# Altium schematic sheet AD.SchDoc
size A4
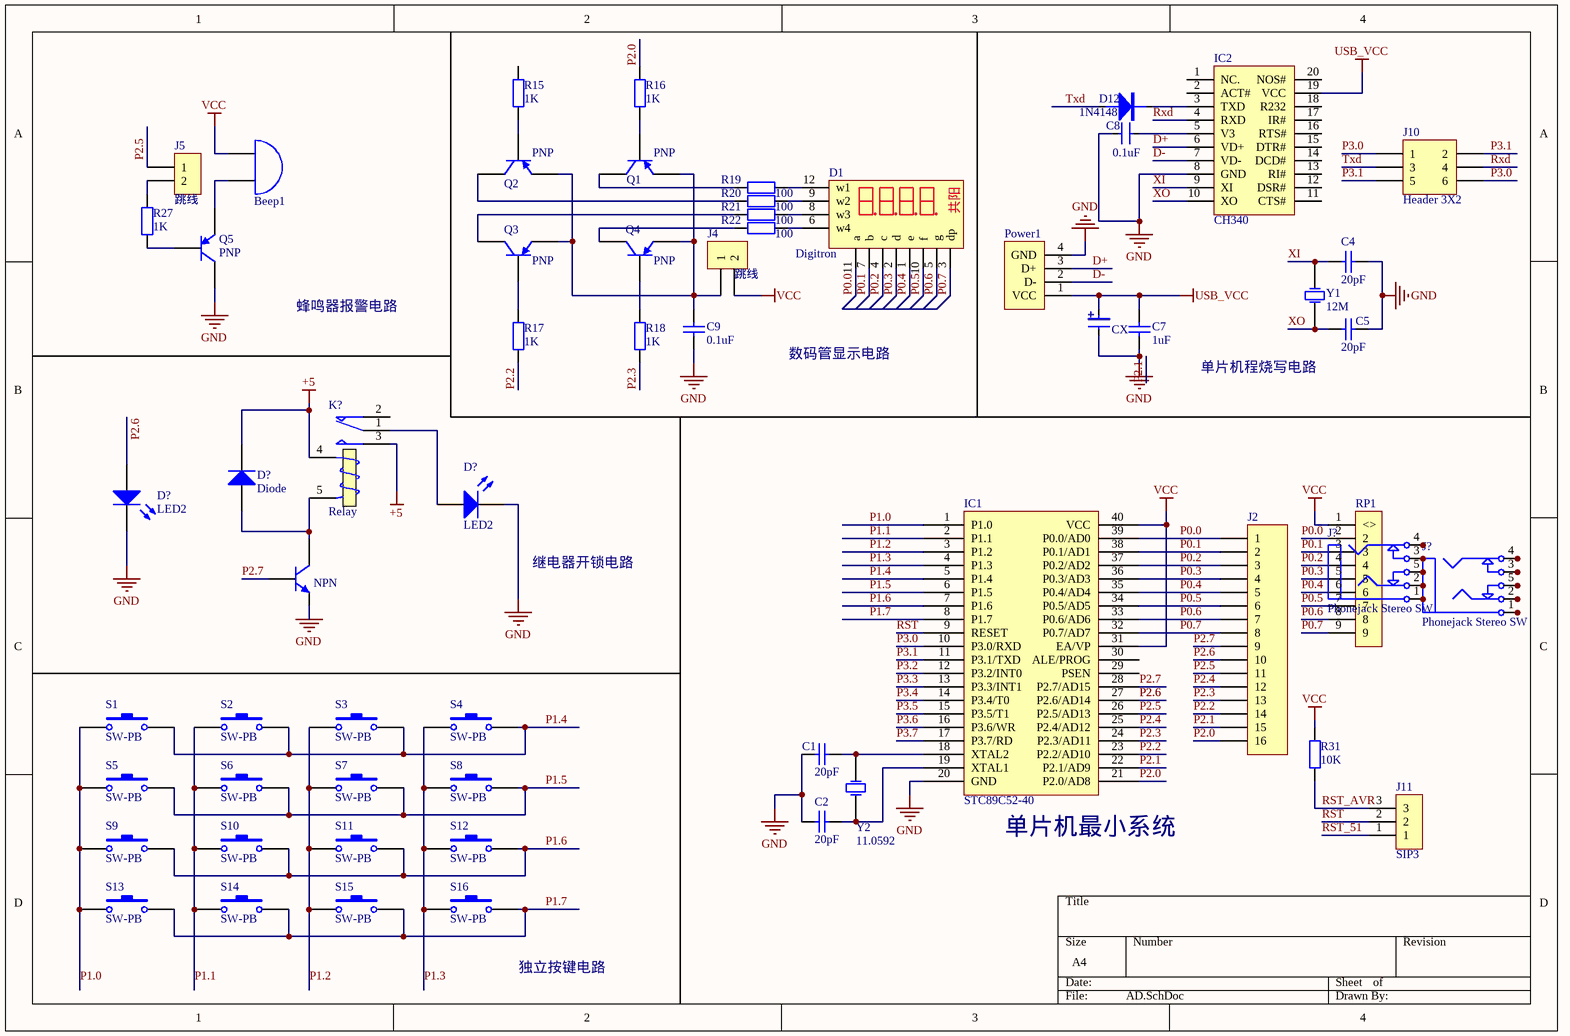
[diagram p0: AD.SchDoc]

## Parts
(Parts that share a designator on the sheet are numbered #1, #2 ... from top to bottom, then left to right.)
?  NPN  [TO-226-AA]
Beep1  蜂鸣器  [beep]  (value not drawn)
C1  value 20pF  [0805_C]  (hidden comment: Cap_SMT)
C2  value 20pF  [0805_C]  (hidden comment: Cap_SMT)
C4  value 20pF  [0805_C]  (hidden comment: Cap_SMT)
C5  value 20pF  [0805_C]  (hidden comment: Cap_SMT)
C7  value 1uF  [0805_C]  (hidden comment: Cap_SMT)
C8  value 0.1uF  [0805C]  (hidden comment: C0805)
C9  value 0.1uF  [0805_C]  (hidden comment: Cap_SMT)
CX  C1206  [C1206_C]  (value not drawn)
D1  Digitron  [Ditigron_Pack]
D12  1N4148  [0805D]
D?#1  Diode  [SMC]
D?#2  LED2  [3.2X1.6X1.1]
D?#3  LED2  [3.2X1.6X1.1]
IC1  STC89C52-40  [DIP_40S]
IC2  CH340  [SSOP-20]
J2  Header 16  [HDR1X16]  (value not drawn)
J4  跳线  [SIP2-0.254]
J5  跳线  [SIP2-0.254]
J10  Header 3X2  [HDR2X3]
J11  SIP3  [SIP3.0-0.254]
J?#1  Phonejack Stereo SW  [ST-3150-5N]
J?#2  Phonejack Stereo SW  [ST-3150-5N]
K?  Relay  [MODULE5B]
Power1  USB-B  [USB-B]  (value not drawn)
Q1  PNP  [SOT-23Q]
Q2  PNP  [SOT-23Q]
Q3  PNP  [SOT-23Q]
Q4  PNP  [SOT-23Q]
Q5  PNP  [SOT-23Q]
R15  value 1K  [0805_R]  (hidden comment: Res_SMT)
R16  value 1K  [0805_R]  (hidden comment: Res_SMT)
R17  value 1K  [0805_R]  (hidden comment: Res_SMT)
R18  value 1K  [0805_R]  (hidden comment: Res_SMT)
R19  value 100  [0805_R]  (hidden comment: Res_SMT)
R20  value 100  [0805_R]  (hidden comment: Res_SMT)
R21  value 100  [0805_R]  (hidden comment: Res_SMT)
R22  value 100  [0805_R]  (hidden comment: Res_SMT)
R27  value 1K  [0805_R]  (hidden comment: Res_SMT)
R31  value 10K  [0805_R]  (hidden comment: Res_SMT)
RP1  排阻9脚  [R9PIN]  (value not drawn)
S1  SW-PB  [SPST-2]
S2  SW-PB  [SPST-2]
S3  SW-PB  [SPST-2]
S4  SW-PB  [SPST-2]
S5  SW-PB  [SPST-2]
S6  SW-PB  [SPST-2]
S7  SW-PB  [SPST-2]
S8  SW-PB  [SPST-2]
S9  SW-PB  [SPST-2]
S10  SW-PB  [SPST-2]
S11  SW-PB  [SPST-2]
S12  SW-PB  [SPST-2]
S13  SW-PB  [SPST-2]
S14  SW-PB  [SPST-2]
S15  SW-PB  [SPST-2]
S16  SW-PB  [SPST-2]
Y1  12M  [HC-49S]
Y2  11.0592  [HC-49S]

## Nets
+5: D?#1.2(K) K?.3(NO) K?.4(T1)
GND: ?.3(E) C1.2 C2.2 C4.2 C5.2 C7.2 C8.1 C9.1 CX.2 D?#2.2(K) D?#3.2(K) IC1.20(GND) IC2.8(GND) Power1.4(GND) Q5.C
USB_VCC: C7.1 CX.1 IC2.19(VCC) Power1.1(VCC)
VCC: Beep1.2(B) IC1.31(EA/VP) IC1.40(VCC) J4.2 R31.2 RP1.1(<>)
D+: IC2.6(VD+) Power1.3(D+)
D-: IC2.7(VD-) Power1.2(D-)
P0.0: D1.11(a) IC1.39(P0.0/AD0) J2.1 RP1.2
P0.1: D1.7(b) IC1.38(P0.1/AD1) J2.2 RP1.3
P0.2: D1.4(c) IC1.37(P0.2/AD2) J2.3 RP1.4
P0.3: D1.2(d) IC1.36(P0.3/AD3) J2.4 RP1.5
P0.4: D1.1(e) IC1.35(P0.4/AD4) J2.5 RP1.6
P0.5: D1.10(f) IC1.34(P0.5/AD5) J2.6 RP1.7
P0.6: D1.5(g) IC1.33(P0.6/AD6) J2.7 RP1.8
P0.7: D1.3(dp) IC1.32(P0.7/AD7) J2.8 RP1.9
P1.0: IC1.1(P1.0) S1.1 S5.1 S9.1 S13.1
P1.1: IC1.2(P1.1) S2.1 S6.1 S10.1 S14.1
P1.2: IC1.3(P1.2) S3.1 S7.1 S11.1 S15.1
P1.3: IC1.4(P1.3) S4.1 S8.1 S12.1 S16.1
P1.4: IC1.5(P1.4) S1.2 S2.2 S3.2 S4.2
P1.5: IC1.6(P1.5) S5.2 S6.2 S7.2 S8.2
P1.6: IC1.7(P1.6) S9.2 S10.2 S11.2 S12.2
P1.7: IC1.8(P1.7) S13.2 S14.2 S15.2 S16.2
P2.0: IC1.21(P2.0/AD8) J2.16 R16.2
P2.1: IC1.22(P2.1/AD9) J2.15
P2.2: IC1.23(P2.2/AD10) J2.14 R17.1
P2.3: IC1.24(P2.3/AD11) J2.13 R18.1
P2.4: IC1.25(P2.4/AD12) J2.12
P2.5: IC1.26(P2.5/AD13) J2.11 J5.1
P2.6: D?#2.1(A) IC1.27(P2.6/AD14) J2.10
P2.7: ?.2(B) IC1.28(P2.7/AD15) J2.9
P3.0: IC1.10(P3.0/RXD) J10.1 J10.6
P3.1: IC1.11(P3.1/TXD) J10.2 J10.5
P3.2: IC1.12(P3.2/INT0)
P3.3: IC1.13(P3.3/INT1)
P3.4: IC1.14(P3.4/T0)
P3.5: IC1.15(P3.5/T1)
P3.6: IC1.16(P3.6/WR)
P3.7: IC1.17(P3.7/RD)
RST: IC1.9(RESET) J11.2
RST_51: J11.1
RST_AVR: J11.3 R31.1
Rxd: IC2.4(RXD) J10.4
Txd: D12.A J10.3
XI: C4.1 IC2.9(XI) Y1.2
XO: C5.1 IC2.10(XO) Y1.1
Net?_1: ?.1(C) D?#1.1(A) K?.5(T2)
NetBeep1_1: Beep1.1(A) Q5.E
NetC1_1: C1.1 IC1.18(XTAL2) Y2.1
NetC2_1: C2.1 IC1.19(XTAL1) Y2.2
NetC8_2: C8.2 IC2.5(V3)
NetC9_2: C9.2 J4.1 Q1.E Q2.E Q3.E Q4.E
NetD1_6: D1.6(w4) R22.2
NetD1_8: D1.8(w3) R21.2
NetD1_9: D1.9(w2) R20.2
NetD1_12: D1.12(w1) R19.2
NetD12_K: D12.K IC2.3(TXD)
NetD?#3_1: D?#3.1(A) K?.1(COM)
NetJ5_2: J5.2 R27.2
NetJ?#1_1: J?#1.1 J?#1.1A J?#1.1B
NetJ?#1_2: J?#1.2 J?#1.2A J?#1.2B
NetJ?#1_3: J?#1.3 J?#1.3A J?#1.3B
NetJ?#1_4: J?#1.4 J?#1.4A J?#1.4B
NetJ?#1_5: J?#1.5 J?#1.5A J?#1.5B
NetJ?#2_1: J?#2.1 J?#2.1A J?#2.1B
NetJ?#2_2: J?#2.2 J?#2.2A J?#2.2B
NetJ?#2_3: J?#2.3 J?#2.3A J?#2.3B
NetJ?#2_4: J?#2.4 J?#2.4A J?#2.4B
NetJ?#2_5: J?#2.5 J?#2.5A J?#2.5B
NetQ1_B: Q1.B R16.1
NetQ1_C: Q1.C R19.1
NetQ2_B: Q2.B R15.1
NetQ2_C: Q2.C R20.1
NetQ3_B: Q3.B R17.2
NetQ3_C: Q3.C R21.1
NetQ4_B: Q4.B R18.2
NetQ4_C: Q4.C R22.1
NetQ5_B: Q5.B R27.1

Not connected (* = marked no-connect by the designer): IC1 29(PSEN) 30(ALE/PROG); IC2 1(NC.) 2(ACT#) 11(CTS#) 12(DSR#) 13(RI#) 14(DCD#) 15(DTR#) 16(RTS#) 17(IR#) 18(R232) 20(NOS#); K? 2(NC); R15 2

## Notes on the sheet
- 蜂鸣器报警电路
- 数码管显示电路
- 单片机程烧写电路
- 继电器开锁电路
- (near IC1) 单片机最小系统
- 独立按键电路
- (in symbol Digitron) 共阳; .

## Library data of the parts
? = NPN: NPN Bipolar Transistor; Published: 8-Jun-2000; LatestRevisionDate: 17-Jul-2002; LatestRevisionNote: Re-released for DXP Platform.; PackageReference: TO-226-AA; Publisher: Altium Limited; PackageDescription: TO, Flat Index; 3 In-Line, Axial Leads; Body Dia. 4.8mm; Leads 0.55 x 0.51 mm (max); Code_JEDEC: TO-226-AA
C1 C2 C4 C5 C7 C9 = Cap_SMT: Capacitor
CX = 钽电容1206: Value: 10uF
D12 = 0805D
D?#1 = Diode: Default Diode; Published: 8-Jun-2000; LatestRevisionDate: 17-Jul-2002; LatestRevisionNote: Re-released for DXP Platform.; PackageVersion: Sep-1996; PackageReference: SMC; Publisher: Altium Limited; PackageDescription: DO-214-AB/SMC; 2 C-Bend Leads; Body 7.9 x 5.9 mm, inc. leads (LxW); Code_JEDEC: DO-214-AB
D?#2 D?#3 = LED2: Typical RED, GREEN, YELLOW, AMBER GaAs LED; Published: 8-Jun-2000; LatestRevisionDate: 17-Jul-2002; LatestRevisionNote: Re-released for DXP Platform.; PackageVersion: Feb-2002; PackageReference: 3.2X1.6X1.1; Publisher: Altium Limited; PackageDescription: SM LED; 2 Flat Leads
J2 = Header 16: Header, 16-Pin; LatestRevisionDate: 17-Jul-2002; LatestRevisionNote: Re-released for DXP Platform.; Publisher: Altium Limited
J4 J5 = SIP2-0.254
J10 = Header 3X2: Header, 3-Pin, Dual row; LatestRevisionDate: 17-Jul-2002; LatestRevisionNote: Re-released for DXP Platform.; Publisher: Altium Limited
J11 = SIP3.0-0.254
J?#1 J?#2 = Phonejack Stereo SW: 3-Conductor Jack with 2 break contacts (normals) and 2 auxiliary make contacts; Published: 5-Jan-2004; LatestRevisionDate: 17-Dec-2003; LatestRevisionNote: PCB Footprint replaced.; DatasheetDocument: 07-Mar-2000; Publisher: Altium Limited; ComponentLink1Description: Manufacturer Link; ComponentLink1URL: http://domino.kycon.com/internet/Products.html
K? = Relay: SPDT Relay; Published: 8-Jun-2000; LatestRevisionDate: 17-Jul-2002; LatestRevisionNote: Re-released for DXP Platform.; PackageReference: MODULE5B; Publisher: Altium Limited
R15-R22 R27 R31 = Res_SMT: Resistor
S1-S16 = SW-PB: Switch; Published: 24-Mar-1999; LatestRevisionDate: 17-Jul-2002; LatestRevisionNote: Re-released for DXP Platform.; PackageReference: SPST-2; Publisher: Altium Limited; PackageDescription: Switch; 2 Leads
Y1 Y2 = XTAL
IC2 = CH340: VALUE: CH340